# Altium schematic sheet connector_and_other.SchDoc
size A3; Organization: Develer s.r.l.; Address1: via Mugellese 1/A; Address2: 50019 Campi Bisenzio; Address3: Firenze; Address4: ITALY; Revision: A; SheetNumber: 1; SheetTotal: 1
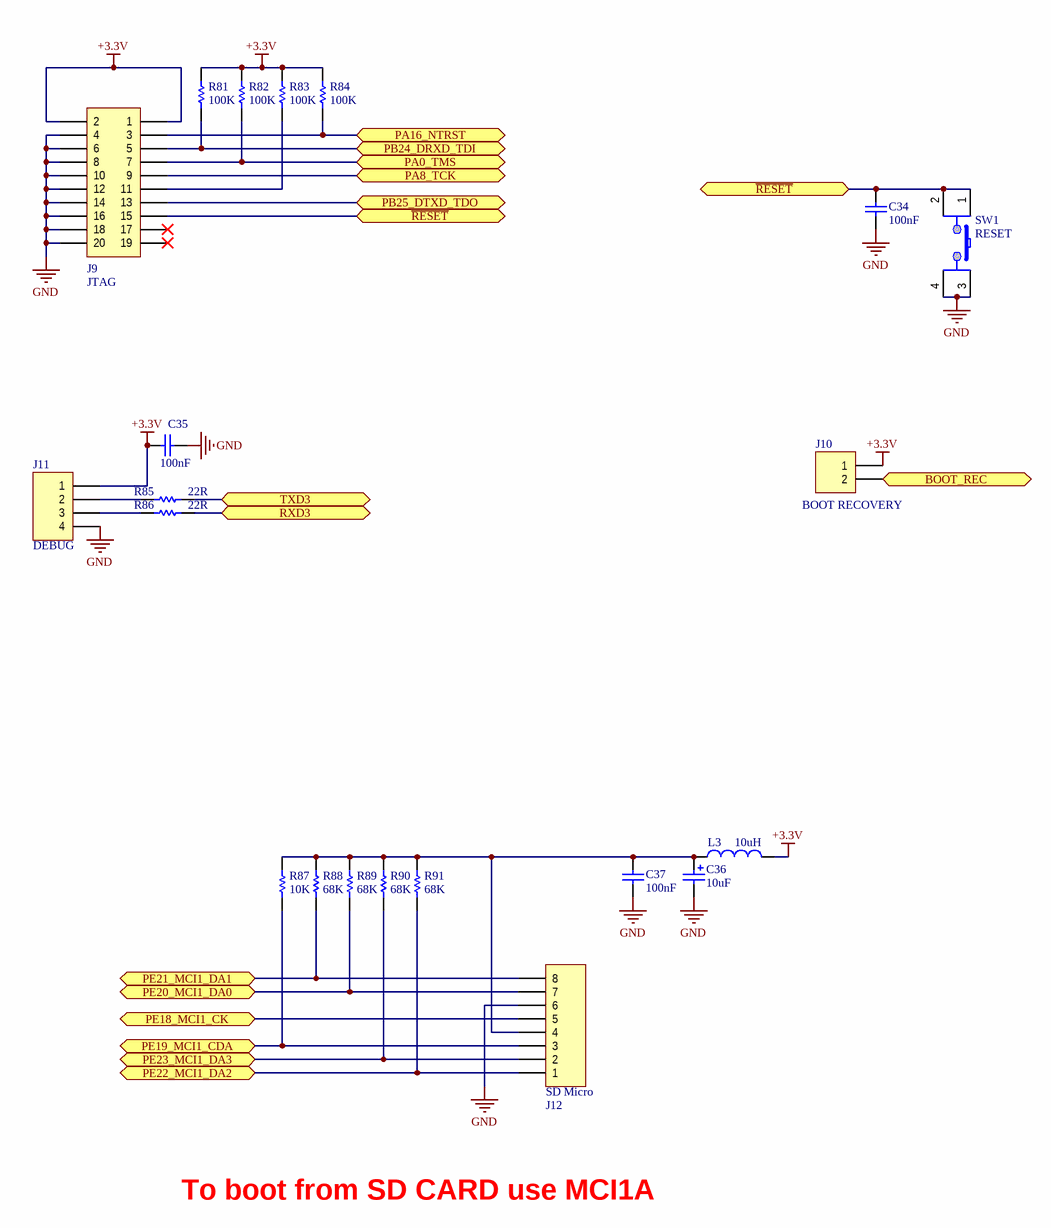
[diagram p0: connector_and_other.SchDoc]

## Parts
C34  100nF  [0603_[1608]]
C35  100nF  [0603_[1608]]
C36  10uF  [1206_[3216]]
C37  100nF  [0603_[1608]]
J9  JTAG  [HEADER_2x10_2.54MM_THD]
J10  BOOT RECOVERY  [HEADER_1X2_2.54MM_THD]
J11  DEBUG  [HEADER_1X4_2.54MM_THD]
J12  SD Micro  [microsd_holder]
L3  10uH  [0603_[1608]]
R81  100K  [0603_[1608]]
R82  100K  [0603_[1608]]
R83  100K  [0603_[1608]]
R84  100K  [0603_[1608]]
R85  22R  [0603_[1608]]
R86  22R  [0603_[1608]]
R87  10K  [0603_[1608]]
R88  68K  [0603_[1608]]
R89  68K  [0603_[1608]]
R90  68K  [0603_[1608]]
R91  68K  [0603_[1608]]
SW1  RESET  [TACTILE_SWITCH_6x6MM_SMD]

## Ports
BOOT_REC, PA0_TMS, PA8_TCK, PA16_NTRST, PB24_DRXD_TDI, PB25_DTXD_TDO, PE18_MCI1_CK, PE19_MCI1_CDA, PE20_MCI1_DA0, PE21_MCI1_DA1, PE22_MCI1_DA2, PE23_MCI1_DA3, RXD3, TXD3, ~{RESET}

## Nets
+3.3V: C35.1 J9.1 J9.2 J10.1 J11.1 L3.2 R81.1 R82.1 R83.1 R84.1
GND: C34.1 C35.2 C36.2 C37.2 J9.4 J9.6 J9.8 J9.10 J9.12 J9.14 J9.16 J9.18 J9.20 J11.4 J12.6 SW1.3 SW1.4
~{RESET}: C34.2 J9.15 SW1.1 SW1.2 ; port ~{RESET}
BOOT_REC: J10.2 ; port BOOT_REC
PA0_TMS: J9.7 R82.2 ; port PA0_TMS
PA8_TCK: J9.9 ; port PA8_TCK
PA16_NTRST: J9.3 R84.2 ; port PA16_NTRST
PB24_DRXD_TDI: J9.5 R81.2 ; port PB24_DRXD_TDI
PB25_DTXD_TDO: J9.13 ; port PB25_DTXD_TDO
PE18_MCI1_CK: J12.5 ; port PE18_MCI1_CK
PE19_MCI1_CDA: J12.3 R87.2 ; port PE19_MCI1_CDA
PE20_MCI1_DA0: J12.7 R89.2 ; port PE20_MCI1_DA0
PE21_MCI1_DA1: J12.8 R88.2 ; port PE21_MCI1_DA1
PE22_MCI1_DA2: J12.1 R91.2 ; port PE22_MCI1_DA2
PE23_MCI1_DA3: J12.2 R90.2 ; port PE23_MCI1_DA3
RXD3: R86.1 ; port RXD3
TXD3: R85.1 ; port TXD3
NetC36_1: C36.1 C37.1 J12.4 L3.1 R87.1 R88.1 R89.1 R90.1 R91.1
NetJ9_11: J9.11 R83.2
NetJ11_2: J11.2 R85.2
NetJ11_3: J11.3 R86.2

Not connected (* = marked no-connect by the designer): J9 17* 19*

## Notes on the sheet
- To boot from SD CARD use MCI1A
- Title:
- Size:
- Rev:
- A3
- Author:
- Approved:
- File:
- Date:
- Time:
- Sheet
- of

## Library data of the parts
C34 C35 = Cap: Ceramic X7R 50V; Value: 10nF; Published: 8-Jun-2000; Revision: July-2002: Re-released for DXP Platform.; Publisher: Altium Limited
C36 = Cap Pol1: Ceramic X5R 25V; Published: 8-Jun-2000; Revision: July-2002: Re-released for DXP Platform.; Publisher: Altium Limited; Value: 10uF
C37 = Cap: Ceramic X7R 50V; Value: 100pF; Published: 8-Jun-2000; LatestRevisionDate: 17-Jul-2002; LatestRevisionNote: Re-released for DXP Platform.; PackageReference: RAD-0.3; Publisher: Altium Limited; PackageDescription: Radial Cap, Thru-Hole; 2 Leads; 0.3 in Pin Spacing
J9 = Header 10X2: Header, 10-Pin, Dual row; LatestRevisionDate: 17-Jul-2002; LatestRevisionNote: Re-released for DXP Platform.; Publisher: Altium Limited
J10 = Header 2: Header, 2-Pin; LatestRevisionDate: 17-Jul-2002; LatestRevisionNote: Re-released for DXP Platform.; Publisher: Altium Limited
J11 = Header 4: Header, 4-Pin; LatestRevisionDate: 17-Jul-2002; LatestRevisionNote: Re-released for DXP Platform.; Publisher: Altium Limited
J12 = Header 8: Header, 8-Pin; LatestRevisionDate: 17-Jul-2002; LatestRevisionNote: Re-released for DXP Platform.; Publisher: Altium Limited
L3 = Inductor: Inductor (MLZ1608N100L); Code_IEC: 1005; Value: 10mH; Published: 8-Jun-2000; LatestRevisionDate: 29-May-2009; LatestRevisionNote: IPC-7351 Footprint Added.; PackageReference: 0402-A; Publisher: Altium Limited; PackageDescription: Chip Inductor; Code_JEITA: 0402
R81-R91 = Res1: Resistor; Value: 1K; Published: 8-Jun-2000; Revision: July-2002: Re-released for DXP Platform.; Publisher: Altium Limited
SW1 = tactile_switch: Tactile switch